# Altium schematic sheet Load_Bank_Master.SchDoc
size 357 x 347 mm; SheetNumber: 1; SheetTotal: 7
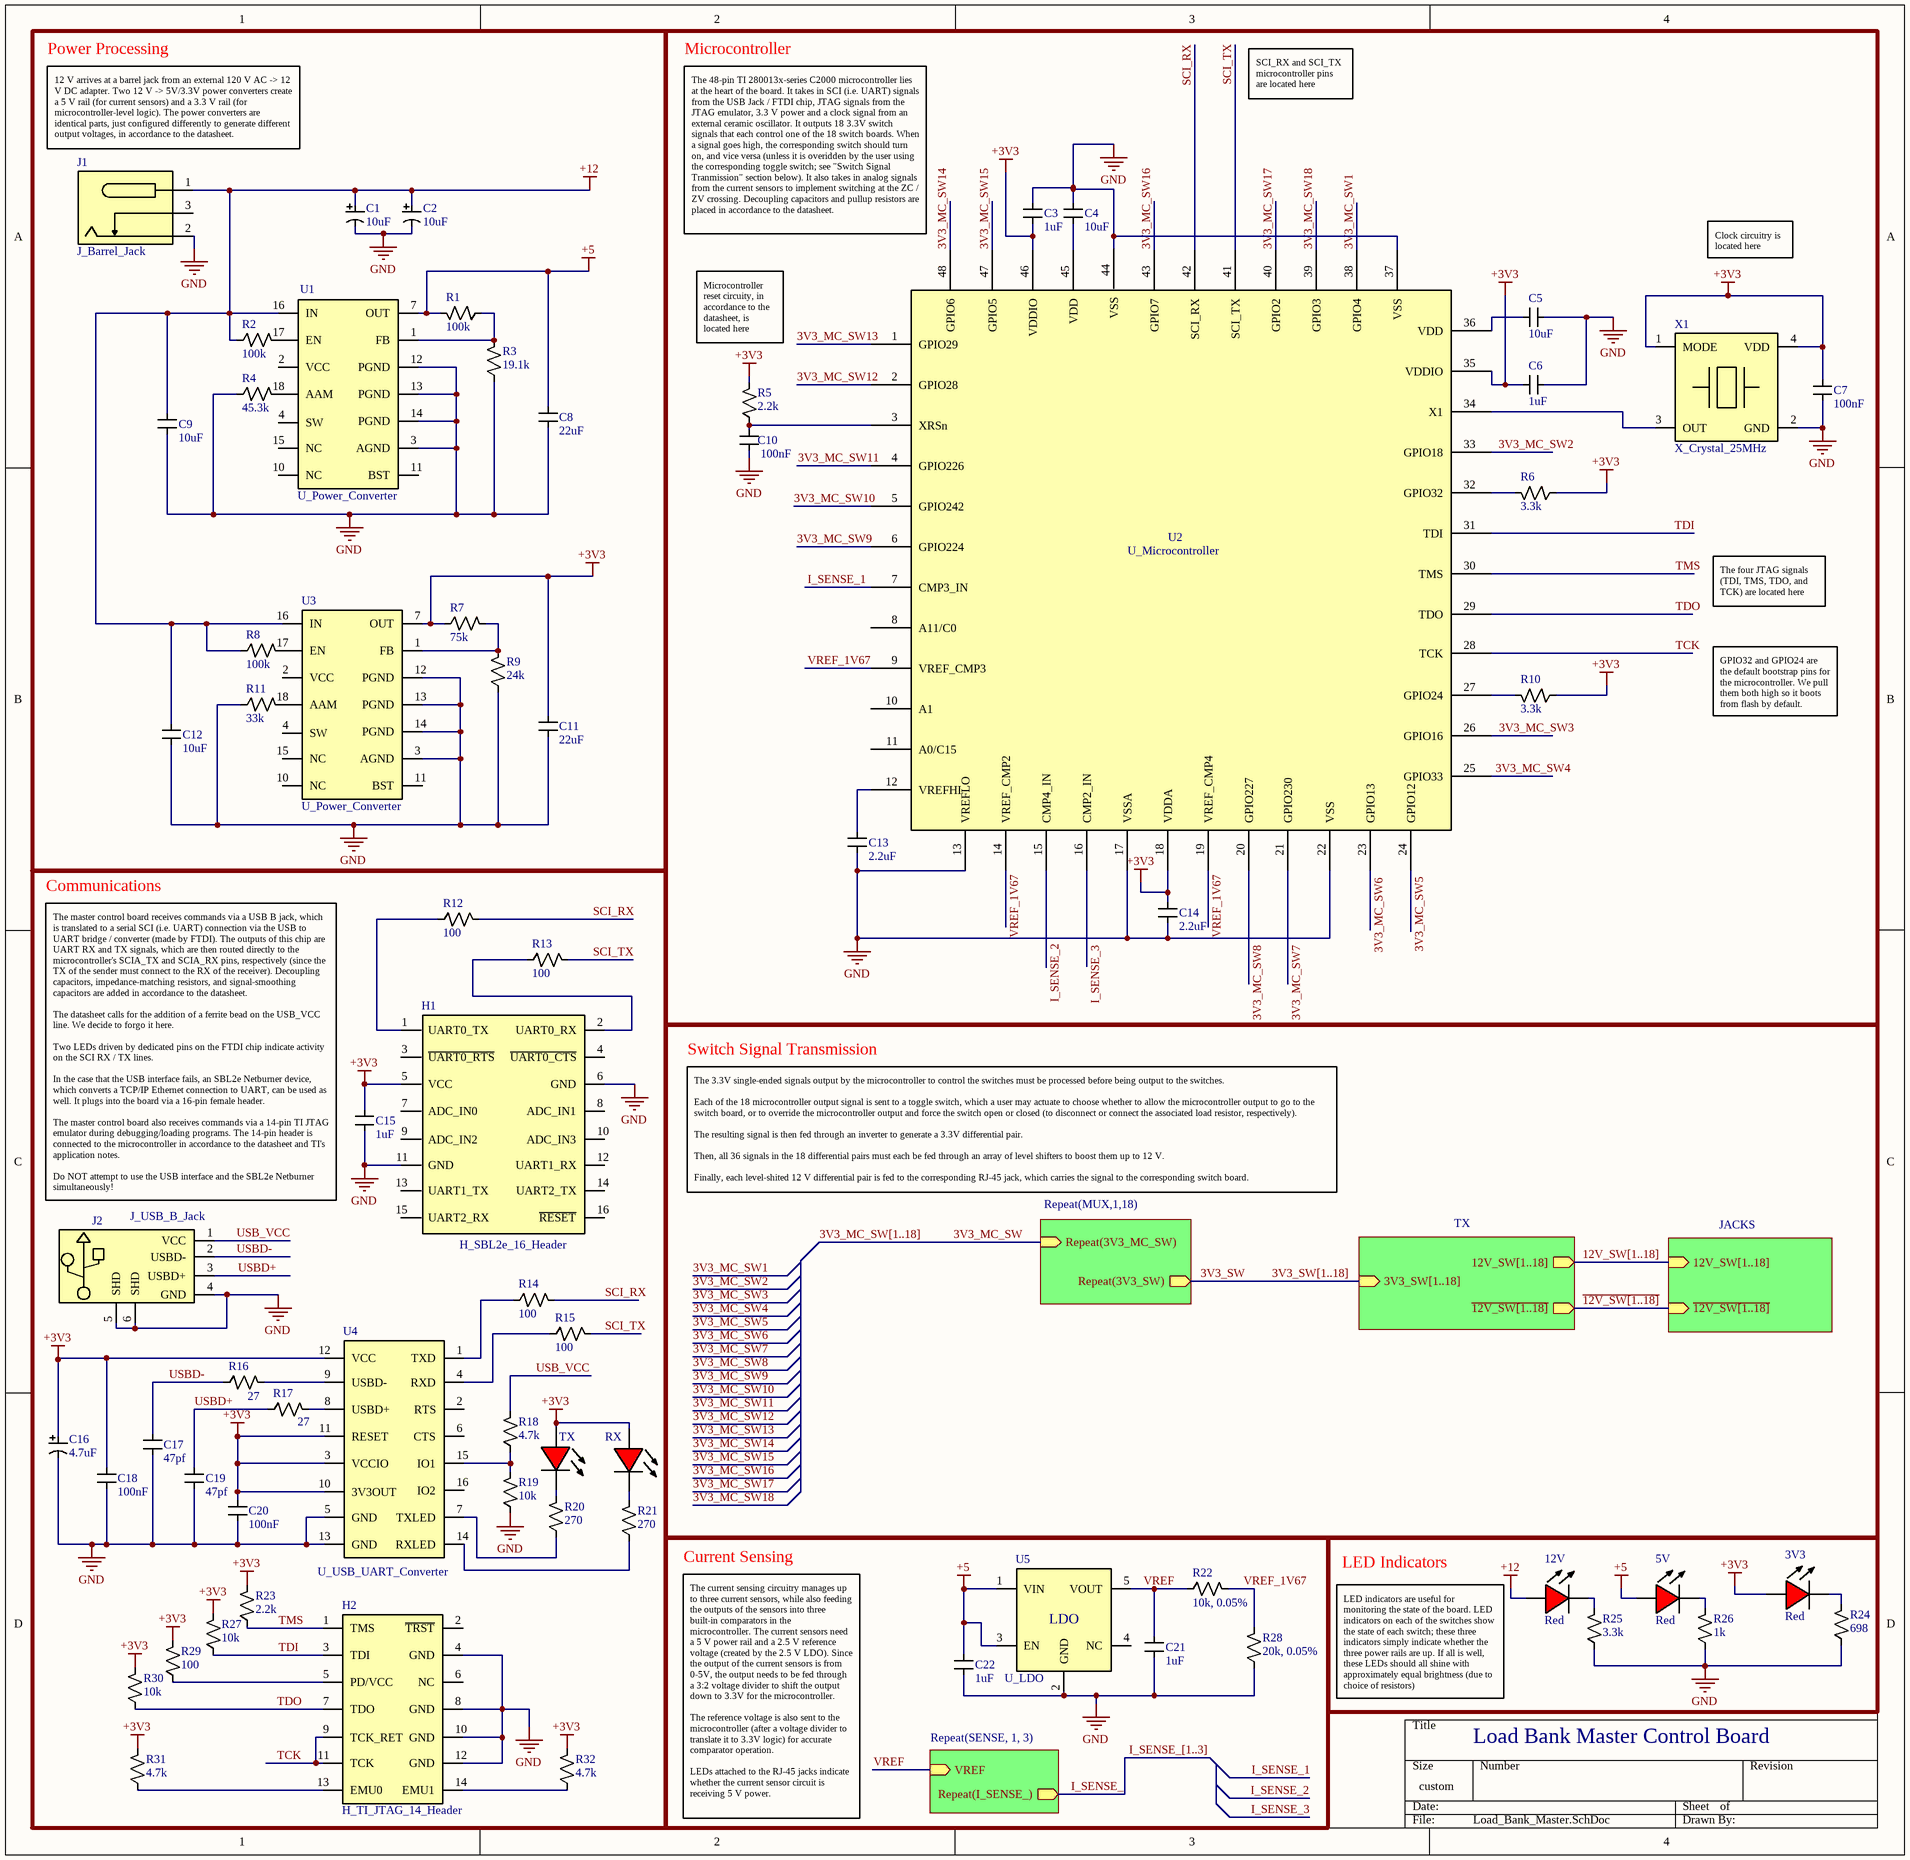
[diagram p0: Load_Bank_Master.SchDoc]

## Parts
3V3  Red  [0603_LED]
5V  Red  [0603_LED]
12V  Red  [0603_LED]
C1  10uF  [ALUM_CAP]
C2  10uF  [ALUM_CAP]
C3  1uF  [0603_CAP]
C4  10uF  [0805_CAP]
C5  10uF  [0805_CAP]
C6  1uF  [0603_CAP]
C7  100nF  [0603_CAP]
C8  22uF  [1206_CAP]
C9  10uF  [0805_CAP]
C10  100nF  [0603_CAP]
C11  22uF  [1206_CAP]
C12  10uF  [0805_CAP]
C13  2.2uF  [0603_CAP]
C14  2.2uF  [0603_CAP]
C15  1uF  [0603_CAP]
C16  4.7uF  [ALUM_CAP]
C17  47pf  [0603_CAP]
C18  100nF  [0603_CAP]
C19  47pf  [0603_CAP]
C20  100nF  [0603_CAP]
C21  1uF  [0603_CAP]
C22  1uF  [0603_CAP]
H1  H_SBL2e_16_Header  [16PIN_HEADER]
H2  H_TI_JTAG_14_Header  [14PIN_HEADER]
J1  J_Barrel_Jack  [PWR_JACK]
J2  J_USB_B_Jack  [USB_B_JACK]
R1  100k  [0603_RES]
R2  100k  [0603_RES]
R3  19.1k  [0603_RES]
R4  45.3k  [0603_RES]
R5  2.2k  [0603_RES]
R6  3.3k  [0603_RES]
R7  75k  [0603_RES]
R8  100k  [0603_RES]
R9  24k  [0603_RES]
R10  3.3k  [0603_RES]
R11  33k  [0603_RES]
R12  100  [0603_RES]
R13  100  [0603_RES]
R14  100  [0603_RES]
R15  100  [0603_RES]
R16  27  [0603_RES]
R17  27  [0603_RES]
R18  4.7k  [0603_RES]
R19  10k  [0603_RES]
R20  270  [0603_RES]
R21  270  [0603_RES]
R22  10k, 0.05%  [0603_RES]
R23  2.2k  [0603_RES]
R24  698  [0603_RES]
R25  3.3k  [0603_RES]
R26  1k  [0603_RES]
R27  10k  [0603_RES]
R28  20k, 0.05%  [0603_RES]
R29  100  [0603_RES]
R30  10k  [0603_RES]
R31  4.7k  [0603_RES]
R32  4.7k  [0603_RES]
RX  Red  [0603_LED]  (value not drawn)
TX  Red  [0603_LED]  (value not drawn)
U1  U_Power_Converter  [PWR_CONVERTER]
U2  U_Microcontroller  [MICROCONTROLLER]
U3  U_Power_Converter  [PWR_CONVERTER]
U4  U_USB_UART_Converter  [TSSOP-16]
U5  U_LDO  [SOT25]
X1  X_Crystal_25MHz  [CRYSTAL]

## Blocks framed on the sheet
Power Processing: C1 C2 C8 C9 C11 C12 J1 R1-R4 R7-R9 R11 U1 U3
Microcontroller: C3-C7 C10 C13 C14 R5 R6 R10 U2 X1
Communications: C15-C20 H1 H2 J2 R12-R21 R23 R27 R29-R32 RX TX U4
Current Sensing: C21 C22 R22 R28 U5
LED Indicators: 3V3 5V 12V R24-R26

## Sub-sheets
JACKS = Jacks.SchDoc: 12V_SW[1..18] (in), ~{12V_SW[1..18]} (in)
Repeat(MUX,1,18) = MUX.SchDoc: Repeat(3V3_MC_SW) (in), Repeat(3V3_SW) (out)
Repeat(SENSE, 1, 3) = Current_Sense.SchDoc: Repeat(I_SENSE_) (out), VREF (in)
TX = TX.SchDoc: 3V3_SW[1..18] (in), 12V_SW[1..18] (out), ~{12V_SW[1..18]} (out)

## Nets
+3V3: 3V3.2 C3.1 C6.1 C7.2 C11.2 C14.2 C15.2 C16.2 C18.2 C20.2 H1.5(VCC) R5.2 R6.1 R7.1 R10.1 R23.2 R27.2 R29.2 R30.2 R31.2 R32.2 RX.2 TX.2 U2.18(VDDA) U2.35(VDDIO) U2.46(VDDIO) U3.7(OUT) U4.3(VCCIO) U4.10(3V3OUT) U4.11(RESET) U4.12(VCC) X1.1(MODE) X1.4(VDD)
+5: 5V.2 C8.2 C22.2 R1.2 U1.7(OUT) U5.1(VIN) U5.3(EN)
+12: 12V.2 C1.2 C2.2 C9.2 C12.2 J1.1(GND) R2.1 R8.1 U1.16(IN) U3.16(IN)
GND: C1.1 C2.1 C3.2 C4.2 C5.2 C6.2 C7.1 C8.1 C9.1 C10.1 C11.1 C12.1 C13.1 C14.1 C15.1 C16.1 C17.1 C18.1 C19.1 C20.1 C21.1 C22.1 H1.6(GND) H1.11(GND) H2.4(GND) H2.8(GND) H2.10(GND) H2.12(GND) J1.2(PWR_JACK) J2.4(GND) J2.5(SHD) J2.6(SHD) R3.1 R4.1 R9.1 R11.1 R19.1 R24.1 R25.1 R26.1 R28.1 U1.3(AGND) U1.12(PGND) U1.13(PGND) U1.14(PGND) U2.13(VREFLO) U2.17(VSSA) U2.22(VSS) U2.37(VSS) U2.44(VSS) U3.3(AGND) U3.12(PGND) U3.13(PGND) U3.14(PGND) U4.5(GND) U4.13(GND) U5.2(GND) X1.2(GND)
3V3_MC_SW: sheet Repeat(MUX,1,18)/Repeat(3V3_MC_SW)
3V3_MC_SW1: U2.38(GPIO4)
3V3_MC_SW2: U2.33(GPIO18)
3V3_MC_SW3: U2.26(GPIO16)
3V3_MC_SW4: U2.25(GPIO33)
3V3_MC_SW5: U2.24(GPIO12)
3V3_MC_SW6: U2.23(GPIO13)
3V3_MC_SW7: U2.21(GPIO230)
3V3_MC_SW8: U2.20(GPIO227)
3V3_MC_SW9: U2.6(GPIO224)
3V3_MC_SW10: U2.5(GPIO242)
3V3_MC_SW11: U2.4(GPIO226)
3V3_MC_SW12: U2.2(GPIO28)
3V3_MC_SW13: U2.1(GPIO29)
3V3_MC_SW14: U2.48(GPIO6)
3V3_MC_SW15: U2.47(GPIO5)
3V3_MC_SW16: U2.43(GPIO7)
3V3_MC_SW17: U2.40(GPIO2)
3V3_MC_SW18: U2.39(GPIO3)
3V3_SW: sheet Repeat(MUX,1,18)/Repeat(3V3_SW)
I_SENSE_: sheet Repeat(SENSE, 1, 3)/Repeat(I_SENSE_)
I_SENSE_1: U2.7(CMP3_IN)
I_SENSE_2: U2.15(CMP4_IN)
I_SENSE_3: U2.16(CMP2_IN)
SCI_RX: R12.2 R14.2 U2.42(SCI_RX)
SCI_TX: R13.2 R15.2 U2.41(SCI_TX)
TCK: H2.9(TCK_RET) H2.11(TCK) U2.28(TCK)
TDI: H2.3(TDI) R27.1 U2.31(TDI)
TDO: H2.7(TDO) R30.1 U2.29(TDO)
TMS: H2.1(TMS) R23.1 U2.30(TMS)
USB_VCC: J2.1(VCC) R18.2
USBD+: C19.2 J2.3(USBD+) R17.1
USBD-: C17.2 J2.2(USBD-) R16.1
VREF: C21.2 R22.1 U5.5(VOUT) ; sheet Repeat(SENSE, 1, 3)/VREF
VREF_1V67: R22.2 R28.2 U2.9(VREF_CMP3) U2.14(VREF_CMP2) U2.19(VREF_CMP4)
Net3V3_1: 3V3.1 R24.2
Net5V_1: 5V.1 R26.2
Net12V_1: 12V.1 R25.2
NetC4_1: C4.1 U2.45(VDD)
NetC5_1: C5.1 U2.36(VDD)
NetC10_2: C10.2 R5.1 U2.3(XRSn)
NetC13_2: C13.2 U2.12(VREFHI)
NetH1_1: H1.1(UART0_TX) R12.1
NetH1_2: H1.2(UART0_RX) R13.1
NetH2_5: H2.5(PD/VCC) R29.1
NetH2_13: H2.13(EMU0) R31.1
NetH2_14: H2.14(EMU1) R32.1
NetR1_1: R1.1 R3.2 U1.1(FB)
NetR2_2: R2.2 U1.17(EN)
NetR4_2: R4.2 U1.18(AAM)
NetR6_2: R6.2 U2.32(GPIO32)
NetR7_2: R7.2 R9.2 U3.1(FB)
NetR8_2: R8.2 U3.17(EN)
NetR10_2: R10.2 U2.27(GPIO24)
NetR11_2: R11.2 U3.18(AAM)
NetR14_1: R14.1 U4.1(TXD)
NetR15_1: R15.1 U4.4(RXD)
NetR16_2: R16.2 U4.9(USBD-)
NetR17_2: R17.2 U4.8(USBD+)
NetR18_1: R18.1 R19.2 U4.15(IO1)
NetR20_1: R20.1 U4.7(TXLED)
NetR20_2: R20.2 TX.1
NetR21_1: R21.1 U4.14(RXLED)
NetR21_2: R21.2 RX.1
NetU2_34: U2.34(X1) X1.3(OUT)

Not connected (* = marked no-connect by the designer): H1 3(~{UART0_RTS}) 4(~{UART0_CTS}) 7(ADC_IN0) 8(ADC_IN1) 9(ADC_IN2) 10(ADC_IN3) 12(UART1_RX) 13(UART1_TX) 14(UART2_TX) 15(UART2_RX) 16(~{RESET}); H2 2(~{TRST}) 6(NC); J1 3(PWR_BAT); U1 2(VCC) 4(SW) 10(NC) 11(BST) 15(NC); U2 8(A11/C0) 10(A1) 11(A0/C15); U3 2(VCC) 4(SW) 10(NC) 11(BST) 15(NC); U4 2(RTS) 6(CTS) 16(IO2); U5 4(NC)

## Buses and harness runs
bus 3V3_MC_SW[1..18]
bus 3V3_SW[1..18] = sheet TX/3V3_SW[1..18]
bus 12V_SW[1..18] = sheet JACKS/12V_SW[1..18] = sheet TX/12V_SW[1..18]
bus I_SENSE_[1..3]
bus ~{12V_SW[1..18]} = sheet JACKS/~{12V_SW[1..18]} = sheet TX/~{12V_SW[1..18]}

## Notes on the sheet
- SCI_RX and SCI_TX microcontroller pins are located here
- (near J1) 12 V arrives at a barrel jack from an external 120 V AC -> 12 V DC adapter. Two 12 V -> 5V/3.3V power converters create a 5 V rail (for current sensors) and a 3.3 V rail (for microcontroller-level logic). The power converters are identical parts, just configured differently to generate different output voltages, in accordance to the datasheet.
- The 48-pin TI 280013x-series C2000 microcontroller lies at the heart of the board. It takes in SCI (i.e. UART) signals from the USB Jack / FTDI chip, JTAG signals from the JTAG emulator, 3.3 V power and a clock signal from an external ceramic oscillator. It outputs 18 3.3V switch signals that each control one of the 18 switch boards. When a signal goes high, the corresponding switch should turn on, and vice versa (unless it is overidden by the user using the corresponding toggle switch; see "Switch Signal Tranmission" section below). It also takes in analog signals from the current sensors to implement switching at the ZC / ZV crossing. Decoupling capacitors and pullup resistors are placed in accordance to the datasheet.
- Clock circuitry is located here
- (near R5) Microcontroller reset circuity, in accordance to the datasheet, is located here
- The four JTAG signals (TDI, TMS, TDO, and TCK) are located here
- GPIO32 and GPIO24 are the default bootstrap pins for the microcontroller. We pull them both high so it boots from flash by default.
- Switch Signal Transmission
- The master control board receives commands via a USB B jack, which is translated to a serial SCI (i.e. UART) connection via the USB to UART bridge / converter (made by FTDI). The outputs of this chip are UART RX and TX signals, which are then routed directly to the microcontroller's SCIA_TX and SCIA_RX pins, respectively (since the TX of the sender must connect to the RX of the receiver). Decoupling capacitors, impedance-matching resistors, and signal-smoothing capacitors are added in accordance to the datasheet.
  The datasheet calls for the addition of a ferrite bead on the USB_VCC line. We decide to forgo it here.
  Two LEDs driven by dedicated pins on the FTDI chip indicate activity on the SCI RX / TX lines.
  In the case that the USB interface fails, an SBL2e Netburner device, which converts a TCP/IP Ethernet connection to UART, can be used as well. It plugs into the board via a 16-pin female header.
  The master control board also receives commands via a 14-pin TI JTAG emulator during debugging/loading programs. The 14-pin header is connected to the microcontroller in accordance to the datasheet and TI's application notes.
  Do NOT attempt to use the USB interface and the SBL2e Netburner simultaneously!
- The 3.3V single-ended signals output by the microcontroller to control the switches must be processed before being output to the switches.
  Each of the 18 microcontroller output signal is sent to a toggle switch, which a user may actuate to choose whether to allow the microcontroller output to go to the switch board, or to override the microcontroller output and force the switch open or closed (to disconnect or connect the associated load resistor, respectively).
  The resulting signal is then fed through an inverter to generate a 3.3V differential pair.
  Then, all 36 signals in the 18 differential pairs must each be fed through an array of level shifters to boost them up to 12 V.
  Finally, each level-shited 12 V differential pair is fed to the corresponding RJ-45 jack, which carries the signal to the corresponding switch board.
- (near 12V) LED indicators are useful for monitoring the state of the board. LED indicators on each of the switches show the state of each switch; these three indicators simply indicate whether the three power rails are up. If all is well, these LEDs should all shine with approximately equal brightness (due to choice of resistors)
- Load Bank Master Control Board
- The current sensing circuitry manages up to three current sensors, while also feeding the outputs of the sensors into three built-in comparators in the microcontroller. The current sensors need a 5 V power rail and a 2.5 V reference voltage (created by the 2.5 V LDO). Since the output of the current sensors is from 0-5V, the output needs to be fed through a 3:2 voltage divider to shift the output down to 3.3V for the microcontroller.
  The reference voltage is also sent to the microcontroller (after a voltage divider to translate it to 3.3V logic) for accurate comparator operation.
  LEDs attached to the RJ-45 jacks indicate whether the current sensor circuit is receiving 5 V power.
- (in symbol U_LDO) LDO

## Library data of the parts
3V3 5V 12V RX TX = LED_0603_Red: LED SMD 0603 Red
C1 C2 = C_10uF_AlElec: Capacitor SMD Aluminum Electrolytic 10 uF
C3 C6 C15 C21 C22 = C_1uF_0603: Capacitor SMD MLCC 1 uF 0603 25 V
C4 C5 C9 C12 = C_10uF_0805: Capacitor SMD MLCC 10 uF 0805
C7 C10 C18 C20 = C_100nF_0603: Capacitor SMD MLCC 100 nF 0603
C8 C11 = C_22uF_1206: Capacitor SMD MLCC 22 uF 25 V 1206
C13 C14 = C_2.2uF_0603: Capacitor SMD MLCC 2.2 uF 0603
C16 = C_4.7uF_AlElec: Capacitor SMD Aluminum Electrolytic 4.7 uF
C17 C19 = C_47pF_0603: Capacitor SMD MLCC 47 pF 0603
H1 = H_SBL2e_16_Header: 16-pin SBL2e Netburner Header
H2 = H_TI_JTAG_14_Header: 14-pin TI JTAG Header
J1 = J_Barrel_Jack: Jack 12 V Barrel Jack Power Plug
J2 = J_USB_B_Jack: Jack USB Type B
R1 R2 R8 = R_100kOhm_0603_0.5%: Resistor 100 kOhm 0603 0.5%
R3 = R_19.1kOhm_0603_0.5%: Resistor 19.1 kOhm 0603 0.5%
R4 = R_45.3kOhm_0603_0.5%: Resistor 45.3 kOhm 0603 0.5%
R5 R23 = R_2.2kOhm_0603_0.5%: Resistor 2.2 kOhm 0603 0.5%
R6 R10 R25 = R_3300Ohm_0603_1%: Resistor 3.3 kOhm 0603 1%
R7 = R_75kOhm_0603_0.5%: Resistor 75 kOhm 0603 0.5%
R9 = R_24kOhm_0603_0.5%: Resistor 24 kOhm 0603 0.5%
R11 = R_33kOhm_0603_0.5%: Resistor 33 kOhm 0603 0.5%
R12-R15 R29 = R_100Ohm_0603_0.5%: Resistor 100 Ohm 0603 0.5%
R16 R17 = R_27Ohm_0603_1%: Resistor 27 Ohm 0603 1%
R18 R31 R32 = R_4.7kOhm_0603_0.5%_1: Resistor 4.7k kOhm 0603 0.5%
R19 R27 R30 = R_10kOhm_0603_0.5%: Resistor 10 kOhm 0603 0.5%
R20 R21 = R_270Ohm_0603_1%: Resistor 270 Ohm 0603 1%
R22 = R_10kOhm_0603_0.05%: Resistor 10 kOhm 0603 0.05%
R24 = R_698Ohm_0603_0.5%: Resistor 698 Ohm 0603 0.5%
R26 = R_1kOhm_0603_0.5%: Resistor 1 kOhm 0603 0.5%
R28 = R_20kOhm_0603_0.05%: Resistor 20 kOhm 0603 0.05%
U1 U3 = U_Power_Converter: IC 12 V to 5V/3.3V switching power converter
U2 = U_Microcontroller: IC TI C2000 Microcontroller, 48-pin LQFP
U4 = U_USB_UART_Converter: FTDI USB to UART Converter TSSOP-16 FT230-XS
U5 = U_LDO: IC 2.5 V LDO
X1 = X_Crystal_25MHz: Crystal Oscillator 25 MHz 3.3 V